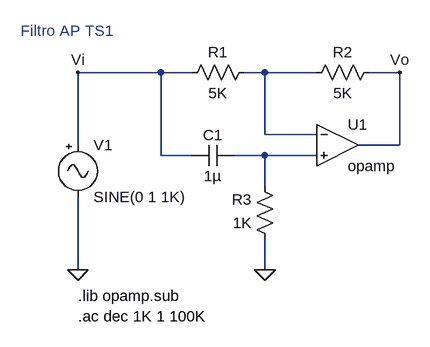
[diagram p0: schematic all_pass.asc]
all_pass.asc, the LTspice schematic file:
Version 4
SHEET 1 880 680
WIRE 144 224 16 224
WIRE 192 224 144 224
WIRE 304 224 272 224
WIRE 384 224 304 224
WIRE 512 224 464 224
WIRE 304 320 304 224
WIRE 384 320 304 320
WIRE 16 336 16 224
WIRE 512 336 512 224
WIRE 512 336 448 336
WIRE 144 352 144 224
WIRE 192 352 144 352
WIRE 304 352 256 352
WIRE 384 352 304 352
WIRE 304 400 304 352
WIRE 16 528 16 416
WIRE 304 528 304 480
FLAG 304 528 0
FLAG 16 528 0
FLAG 512 224 Vo
FLAG 16 224 Vi
SYMBOL res 288 208 R90
WINDOW 0 0 56 VBottom 2
WINDOW 3 32 56 VTop 2
SYMATTR InstName R1
SYMATTR Value 5K
SYMBOL res 480 208 R90
WINDOW 0 0 56 VBottom 2
WINDOW 3 32 56 VTop 2
SYMATTR InstName R2
SYMATTR Value 5K
SYMBOL res 320 496 R180
WINDOW 0 36 76 Left 2
WINDOW 3 36 40 Left 2
SYMATTR InstName R3
SYMATTR Value 1K
SYMBOL cap 256 336 R90
WINDOW 0 0 32 VBottom 2
WINDOW 3 32 32 VTop 2
SYMATTR InstName C1
SYMATTR Value 1µ
SYMBOL Opamps/opamp 416 272 R0
SYMATTR InstName U1
SYMBOL Misc/signal 16 320 R0
SYMATTR InstName V1
SYMATTR Value2 AC 1
TEXT 16 568 Left 2 !.lib opamp.sub
TEXT 16 600 Left 2 !.ac dec 1K 1 100K
TEXT -72 160 Left 2 ;Filtro AP TS1

The netlist it stands for:
* all_pass.asc
R1 N001 Vi 5K
R2 Vo N001 5K
R3 0 N002 1K
C1 N002 Vi 1µ
XU1 N001 N002 Vo opamp Aol=100K GBW=10Meg  ; pins invin noninvin out
V1 Vi 0 SINE(0 1 1K) AC 1
.lib opamp.sub
.ac dec 1K 1 100K
* Filtro AP TS1
.backanno
.end